# Altium project DE-010824.PrjPcb
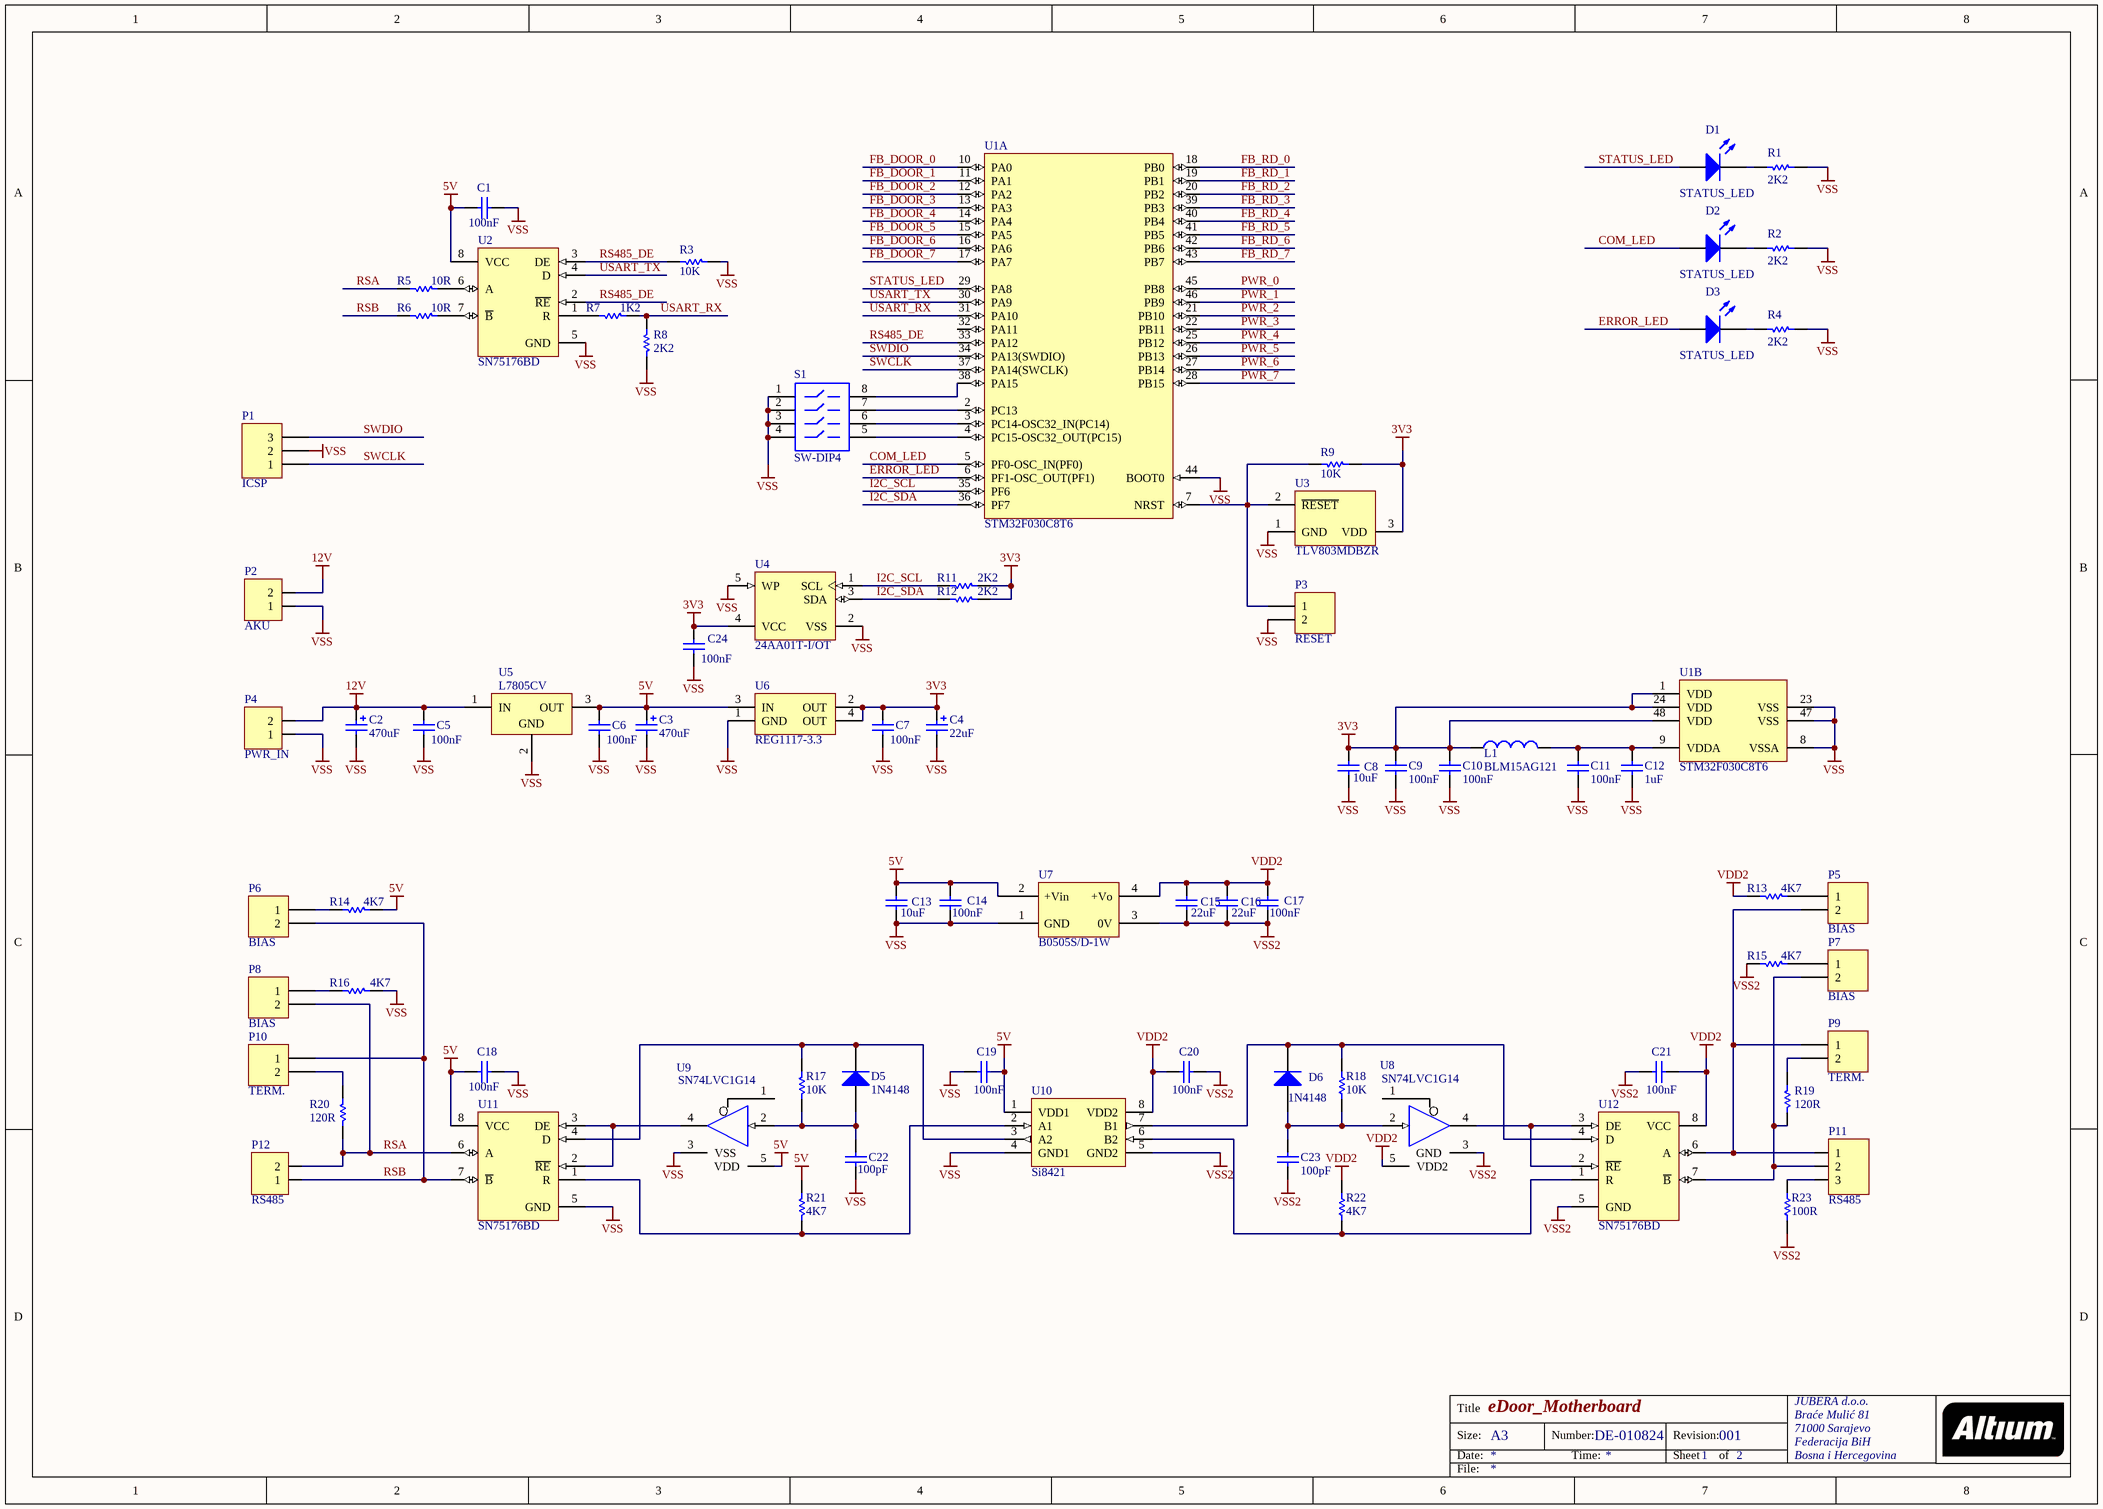
[diagram p0: DE-010824.SchDoc]
2 sheets, 221 parts. Net scope: global (net labels, ports and power ports of the same name join across sheets).
Board file: DE-010824.PcbDoc
Sheets:
  DE-010824.SchDoc
  DE-010824_02.SchDoc

## Sheet DE-010824.SchDoc: eDoor_Motherboard
size A3; Author: eldar6776@hotmail.com; DrawnBy: Eldar Dedic; Organization: JUBERA d.o.o.; Address1: Braće Mulić 81; Address2: 71000 Sarajevo; Address3: Federacija BiH; Address4: Bosna i Hercegovina; DocumentNumber: DE-010824; Revision: 001; SheetNumber: 1; SheetTotal: 2

### Parts
C1  100nF  [0603]
C2  470uF  [CAPPR5-10X12.5]
C3  470uF  [CAPPR5-10X12.5]
C4  22uF  [CAPPR2-5X11]
C5  100nF  [0603]
C6  100nF  [0603]
C7  100nF  [0603]
C8  10uF  [0805]
C9  100nF  [0603]
C10  100nF  [0603]
C11  100nF  [0603]
C12  1uF  [0603]
C13  10uF  [0805]
C14  100nF  [0603]
C15  22uF  [0805]
C16  22uF  [0805]
C17  100nF  [0603]
C18  100nF  [0603]
C19  100nF  [0603]
C20  100nF  [0603]
C21  100nF  [0603]
C22  100pF  [0603]
C23  100pF  [0603]
C24  100nF  [0603]
D1  STATUS_LED  [1.6X0.8X0.8]
D2  STATUS_LED  [1.6X0.8X0.8]
D3  STATUS_LED  [1.6X0.8X0.8]
D5  1N4148  [SOD323]
D6  1N4148  [SOD323]
L1  BLM15AG121  [0603]
P1  ICSP  [HDR1X3]
P2  AKU  [TERMINAL BLOK 2]
P3  RESET  [HDR1X2]
P4  PWR_IN  [TERMINAL BLOK 2]
P5  BIAS  [HDR1X2]
P6  BIAS  [HDR1X2]
P7  BIAS  [HDR1X2]
P8  BIAS  [HDR1X2]
P9  TERM.  [HDR1X2]
P10  TERM.  [HDR1X2]
P11  RS485  [TERMINAL BLOK 3]
P12  RS485  [TERMINAL BLOK 2]
R1  2K2  [ERA-0603]
R2  2K2  [ERA-0603]
R3  10K  [ERA-0603]
R4  2K2  [ERA-0603]
R5  10R  [ERA-0603]
R6  10R  [ERA-0603]
R7  1K2  [ERA-0603]
R8  2K2  [ERA-0603]
R9  10K  [ERA-0603]
R11  2K2  [ERA-0603]
R12  2K2  [ERA-0603]
R13  4K7  [ERA-0603]
R14  4K7  [ERA-0603]
R15  4K7  [ERA-0603]
R16  4K7  [ERA-0603]
R17  10K  [ERA-0603]
R18  10K  [ERA-0603]
R19  120R  [ERA-0603]
R20  120R  [ERA-0603]
R21  4K7  [ERA-0603]
R22  4K7  [ERA-0603]
R23  100R  [ERA-0805]
S1  SW-DIP4  [DIP-8]
U1  STM32F030C8T6  [STM-LQFP48_N]  (parts A,B of 2)
U2  SN75176BD  [D008_N]
U3  TLV803MDBZR  [DBZ3_N]
U4  24AA01T-I/OT  [SOT-23-OT5_N]
U5  L7805CV  [TO220]
U6  REG1117-3.3  [ZZ311]
U7  B0505S/D-1W  [B0505S-1W]
U8  SN74LVC1G14  [419A-01_N]
U9  SN74LVC1G14  [419A-01_N]
U10  Si8421  [SOP8]
U11  SN75176BD  [D008_N]
U12  SN75176BD  [D008_N]

### Nets
3V3: C4.1 C7.2 C8.2 C9.1 C10.1 C24.2 L1.1 R9.2 R11.2 R12.2 U1.1(VDD) U1.24(VDD) U1.48(VDD) U3.3(VDD) U4.4(VCC) U6.2(OUT) U6.4(OUT)
5V: C1.1 C3.1 C6.2 C13.2 C14.2 C15.2 C16.2 C17.2 C18.1 C19.2 C20.2 C21.1 R13.2 R14.2 R21.2 R22.2 U2.8(VCC) U5.3(OUT) U6.3(IN) U7.2(+Vin) U7.4(+Vo) U8.5(VDD2) U9.5(VDD) U10.1(VDD1) U10.8(VDD2) U11.8(VCC) U12.8(VCC)  [also labelled VDD, VDD2]
12V: C2.1 C5.2 P2.2 P4.2 U5.1(IN)
GND: C1.2 C2.2 C3.2 C4.2 C5.1 C6.1 C7.1 C8.1 C9.2 C10.2 C11.2 C12.2 C13.1 C14.1 C15.1 C16.1 C17.1 C18.2 C19.1 C20.1 C21.2 C22.1 C23.1 C24.1 P1.2 P2.1 P3.2 P4.1 R1.1 R2.1 R3.1 R4.1 R8.2 R15.2 R16.2 R23.1 S1.1 S1.2 S1.3 S1.4 U1.8(VSSA) U1.23(VSS) U1.44(BOOT0) U1.47(VSS) U2.5(GND) U3.1(GND) U4.2(VSS) U4.5(WP) U5.2(GND) U6.1(GND) U7.1(GND) U7.3(0V) U8.3(GND) U9.3(VSS) U10.4(GND1) U10.5(GND2) U11.5(GND) U12.5(GND)  [also labelled VSS, VSS2]
COM_LED: D2.1(A) U1.5(PF0-OSC_IN(PF0))
ERROR_LED: D3.1(A) U1.6(PF1-OSC_OUT(PF1))
FB_DOOR_0: U1.10(PA0)
FB_DOOR_1: U1.11(PA1)
FB_DOOR_2: U1.12(PA2)
FB_DOOR_3: U1.13(PA3)
FB_DOOR_4: U1.14(PA4)
FB_DOOR_5: U1.15(PA5)
FB_DOOR_6: U1.16(PA6)
FB_DOOR_7: U1.17(PA7)
FB_RD_0: U1.18(PB0)
FB_RD_1: U1.19(PB1)
FB_RD_2: U1.20(PB2)
FB_RD_3: U1.39(PB3)
FB_RD_4: U1.40(PB4)
FB_RD_5: U1.41(PB5)
FB_RD_6: U1.42(PB6)
FB_RD_7: U1.43(PB7)
I2C_SCL: R11.1 U1.35(PF6) U4.1(SCL)
I2C_SDA: R12.1 U1.36(PF7) U4.3(SDA)
PWR_0: U1.45(PB8)
PWR_1: U1.46(PB9)
PWR_2: U1.21(PB10)
PWR_3: U1.22(PB11)
PWR_4: U1.25(PB12)
PWR_5: U1.26(PB13)
PWR_6: U1.27(PB14)
PWR_7: U1.28(PB15)
RS485_DE: R3.2 U1.33(PA12) U2.2(~{RE}) U2.3(DE)
RSA: P8.2 P12.2 R5.1 R20.1 U11.6(A)
RSB: P6.2 P10.1 P12.1 R6.1 U11.7(~{B})
STATUS_LED: D1.1(A) U1.29(PA8)
SWCLK: P1.1 U1.37(PA14(SWCLK))
SWDIO: P1.3 U1.34(PA13(SWDIO))
USART_RX: R7.1 R8.1 U1.31(PA10)
USART_TX: U1.30(PA9) U2.4(D)
NetC11_1: C11.1 C12.1 L1.2 U1.9(VDDA)
NetC22_2: C22.2 D5.2(A) R17.1 U9.2(A)
NetC23_2: C23.2 D6.2(A) R18.1 U8.2(A)
NetD1_2: D1.2(K) R1.2
NetD2_2: D2.2(K) R2.2
NetD3_2: D3.2(K) R4.2
NetD5_1: D5.1(K) R17.2 U10.3(A2) U11.4(D)
NetD6_1: D6.1(K) R18.2 U10.7(B1) U12.4(D)
NetP3_1: P3.1 R9.1 U1.7(NRST) U3.2(~{RESET})
NetP5_1: P5.1 R13.1
NetP5_2: P5.2 P9.1 P11.1 U12.6(A)
NetP6_1: P6.1 R14.1
NetP7_1: P7.1 R15.1
NetP7_2: P7.2 P11.2 R19.1 U12.7(~{B})
NetP8_1: P8.1 R16.1
NetP9_2: P9.2 R19.2
NetP10_2: P10.2 R20.2
NetP11_3: P11.3 R23.2
NetR5_2: R5.2 U2.6(A)
NetR6_2: R6.2 U2.7(~{B})
NetR7_2: R7.2 U2.1(R)
NetR21_1: R21.1 U10.2(A1) U11.1(R)
NetR22_1: R22.1 U10.6(B2) U12.1(R)
NetS1_5: S1.5 U1.4(PC15-OSC32_OUT(PC15))
NetS1_6: S1.6 U1.3(PC14-OSC32_IN(PC14))
NetS1_7: S1.7 U1.2(PC13)
NetS1_8: S1.8 U1.38(PA15)
NetU8_4: U8.4(Y) U12.2(~{RE}) U12.3(DE)
NetU9_4: U9.4(Y) U11.2(~{RE}) U11.3(DE)

Not connected (* = marked no-connect by the designer): U1 32(PA11); U8 1(NC); U9 1(NC)

### Notes on the sheet
- Title
- Size:
- Date:
- A3
- Number:
- Time:
- Revision:
- Sheet
- of
- File:

### Library data of the parts
C1 C5-C7 C9-C11 C14 C17-C24 = C0603: Ceramic Chip Capacitor - Standard; Note: Footprint corresponds to dimensions for bulk cassette packaging. This case size has tightened tolerances.; Published: 17-Jul-2002; LatestRevisionDate: 19-Mar-2004; LatestRevisionNote: Silkscreen size reduced.; DatasheetDocument: Mar-2001; PackageDocument: Mar-2001; PackageReference: 0603; Publisher: Altium Limited; Code_JEITA: 0603; Code_IPC: 1608 [0603]; ComponentLink1Description: Manufacturer Link; ComponentLink1URL: http://www.kemet.com/; ComponentLink2Description: Datasheet; ComponentLink2URL: http://www.kemet.com/kemet/web/homepage/kechome.nsf/vapubfilesname/F3102TA.pdf/$file/F3102TA.pdf
  C1 C5-C7 C9-C11 C14 C17-C21 C24: Value: 100nF
  C22 C23: Value: 100pF
C2 C3 = EKA00DC347E00: Aluminum Electrolytic Capacitor, Radial Style with Long Leads: 470uF, 25V; Note: Refer to Manufacturer's Data Sheets for other lead formations; DrillSize: Nominal, Rounded To The Nearest 0.1mm; Published: 19-Mar-2004; DatasheetDocument: 20-Feb-2001; PackageReference: CAPPR5-10X12.5; Publisher: Altium Limited; ComponentLink1Description: Manufacturer Link; ComponentLink1URL: http://www.vishay.com/; ComponentLink2Description: Datasheet; ComponentLink2URL: http://www.vishay.com/docs/25014/eka.pdf; Value: 470uF
C4 = EKA00AA247F00: Aluminum Electrolytic Capacitor, Radial Style with Long Leads: 47uF, 35V; Note: Refer to Manufacturer's Data Sheets for other lead formations; DrillSize: Nominal, Rounded To The Nearest 0.1mm; Published: 19-Mar-2004; DatasheetDocument: 20-Feb-2001; PackageReference: CAPPR2-5X11; Publisher: Altium Limited; ComponentLink1Description: Manufacturer Link; ComponentLink1URL: http://www.vishay.com/; ComponentLink2Description: Datasheet; ComponentLink2URL: http://www.vishay.com/docs/25014/eka.pdf; Value: 47uF
C8 C13 = C0805: Ceramic Chip Capacitor - Standard; Note: Footprint corresponds to dimensions for bulk cassette packaging. This case size has tightened tolerances.; Published: 17-Jul-2002; LatestRevisionDate: 19-Mar-2004; LatestRevisionNote: Silkscreen size reduced.; DatasheetDocument: Mar-2001; PackageDocument: Mar-2001; PackageReference: 0805; Publisher: Altium Limited; Code_JEITA: 0805; Code_IPC: 2012[0805]; ComponentLink1Description: Manufacturer Link; ComponentLink1URL: http://www.kemet.com/; ComponentLink2Description: Datasheet; ComponentLink2URL: http://www.kemet.com/kemet/web/homepage/kechome.nsf/vapubfilesname/F3102TA.pdf/$file/F3102TA.pdf; Value: 10uF
C12 = C0603: Ceramic Chip Capacitor - Standard; Note: Footprint corresponds to dimensions for bulk cassette packaging. This case size has tightened tolerances.; Value: 100nF; Published: 17-Jul-2002; LatestRevisionDate: 19-Mar-2004; LatestRevisionNote: Silkscreen size reduced.; DatasheetDocument: Mar-2001; PackageDocument: Mar-2001; PackageReference: 0603; Publisher: Altium Limited; Code_JEITA: 0603; Code_IPC: 1608 [0603]; ComponentLink1Description: Manufacturer Link; ComponentLink1URL: http://www.kemet.com/; ComponentLink2Description: Datasheet; ComponentLink2URL: http://www.kemet.com/kemet/web/homepage/kechome.nsf/vapubfilesname/F3102TA.pdf/$file/F3102TA.pdf
C15 C16 = C0805: Ceramic Chip Capacitor - Standard; Note: Footprint corresponds to dimensions for bulk cassette packaging. This case size has tightened tolerances.; Value: 10uF; Published: 17-Jul-2002; LatestRevisionDate: 19-Mar-2004; LatestRevisionNote: Silkscreen size reduced.; DatasheetDocument: Mar-2001; PackageDocument: Mar-2001; PackageReference: 0805; Publisher: Altium Limited; Code_JEITA: 0805; Code_IPC: 2012[0805]; ComponentLink1Description: Manufacturer Link; ComponentLink1URL: http://www.kemet.com/; ComponentLink2Description: Datasheet; ComponentLink2URL: http://www.kemet.com/kemet/web/homepage/kechome.nsf/vapubfilesname/F3102TA.pdf/$file/F3102TA.pdf
D1-D3 = HSMB-C190: Blue Surface Mount Chip LED, Blue; LuminousIntensity: 1.6mcd (Minimum).; PCB_Layout: Complies with manufacturer's recommendation.; Published: 11-Dec-2002; DatasheetVersion: 26-Feb-2002; PackageVersion: Mar-2002; PackageReference: 1.6X0.8X0.8; Publisher: Altium Limited; PackageDescription: SM LED; 2 Flat Leads; LED_Colour: Blue; ComponentLink1Description: Manufacturer Link; ComponentLink1URL: http://www.avagotech.com/; ComponentLink2Description: Datasheet; ComponentLink2URL: http://cp.literature.agilent.com/litweb/pdf/5988-5211EN.pdf
D5 D6 = BAS321: General-purpose Diode; Published: 17-Sep-2003; LatestRevisionDate: 19-Mar-2004; LatestRevisionNote: Silkscreen size reduced.; DatasheetVersion: 9-Feb-1999; PackageVersion: May-1999; PackageReference: SOD323; Publisher: Altium Limited; PackageDescription: SOD-323/SC-76; 2 Leads; Body 1.7 x 1.3 mm, (LxW); ComponentLink1Description: Manufacturer Link; ComponentLink1URL: http://www.semiconductors.philips.com/; ComponentLink2Description: Datasheet; ComponentLink2URL: http://www.semiconductors.philips.com/acrobat/datasheets/BAS321_2.pdf
L1 = Chip inductor: SMD chip inductor; Code_IEC: 1005; Published: 8-Jun-2000; LatestRevisionDate: 29-May-2009; LatestRevisionNote: IPC-7351 Footprint Added.; PackageReference: 0402-A; Publisher: Altium Limited; PackageDescription: Chip Inductor; Code_JEITA: 0402
P1 = Header 3: Header, 3-Pin; LatestRevisionDate: 17-Jul-2002; LatestRevisionNote: Re-released for DXP Platform.; Publisher: Altium Limited
P2 P4 P12 = TERMINAL BLOK 2: Terminal blok konektor 3,5 mm
P3 P5-P10 = Header 2: Header, 2-Pin; LatestRevisionDate: 17-Jul-2002; LatestRevisionNote: Re-released for DXP Platform.; Publisher: Altium Limited
P11 = TERMINAL BLOK 3: 3 pinski terminal blok konektor
R1-R9 R11-R22 = ERAV: Metal Film Thermosensitive Chip Resistor, 0.56 Ohm to 10k Ohm Range, 5% Tolerance, 0603 Size, 0.063 W; Note: If flow soldering, adjust pad width of PCB Footprint to 0.7 - 0.8 times the width of the resistor.; Published: 17-Dec-2003; LatestRevisionDate: 19-Mar-2004; LatestRevisionNote: Silkscreen size reduced.; PackageDocument: Mar-2003; PackageReference: ERA-0603; Publisher: Altium Limited; Code_IPC: 1608 [0603]; ComponentLink1Description: Manufacturer Link; ComponentLink1URL: http://www.panasonic.com/industrial/components/resistive_products.htm; ComponentLink2Description: Datasheet; ComponentLink2URL: http://www.panasonic.com/industrial/components/pdf/AOF0000CE1.pdf
R23 = ERA6Y: Rectangular Thick Film Chip Resistor, 10 Ohm to 1M Ohm Range, 0.1% and 0.5% Tolerance, 0805 Size, 0.1 W; Note: If flow soldering, adjust pad width of PCB Footprint to 0.7 - 0.8 times the width of the resistor.; Published: 17-Dec-2003; LatestRevisionDate: 19-Mar-2004; LatestRevisionNote: Silkscreen size reduced.; PackageDocument: Mar-2003; PackageReference: ERA-0805; Publisher: Altium Limited; Code_IPC: 2012 [0805]; ComponentLink1Description: Manufacturer Link; ComponentLink1URL: http://www.panasonic.com/industrial/components/resistive_products.htm; ComponentLink2Description: Datasheet; ComponentLink2URL: http://www.panasonic.com/industrial/components/pdf/AOA0000CE8.pdf
S1 = SW-DIP4: DIP Switch; Published: 24-Mar-1999; LatestRevisionDate: 17-Jul-2002; LatestRevisionNote: Re-released for DXP Platform.; PackageReference: DIP-8; Publisher: Altium Limited
U1 = STM32F030C8T6: ARM Cortex-M0 32-bit MCU, 64 KB Flash, 8 KB Internal RAM, 39 I/Os, 48-pin LQFP, -40 to 85 degC, Tray; FLASH Size (Prog) (kB): 64; I/Os (High Current): 39; Internal RAM Size (kB): 8; Operating Frequency(F) (Processor speed) (MHz): 48; Supply Voltage(Vcc) min (V): 2.4; DatasheetVersion: Rev. 1; PackageVersion: Rev. 6, 06/2013; PackageReference: LQFP48; PackageDescription: 48-Pin Low Profile Quad Flat Package, 7 x 7 mm Body, 0.5 mm Pitch; Supplier 1: Digi-Key; Supplier Part Number 1: 497-14043-ND; Supplier 2: Newark; Supplier Part Number 2: 06X3647; Supplier 3: Mouser; Supplier Part Number 3: 511-STM32F030C8T6; Core: ARM Cortex-M0; Packing: Tray; Mounting Technology: Surface Mount; PartNumber: STM32F030C8T6; ComponentLink1Description: Manufacturer URL; ComponentLink1URL: http://www.st.com/web/en/home.html; ComponentLink2Description: Datasheet; ComponentLink2URL: http://www.st.com/st-web-ui/static/active/en/resource/technical/document/datasheet/DM00088500.pdf; ComponentLink3Description: Package Specification; ComponentLink3URL: http://www.st.com/st-web-ui/static/active/en/resource/technical/document/datasheet/DM00058181.pdf
U2 U11 U12 = SN75176BD: Differential Bus Transceiver; Note: Receiver Hysteresis of 50mV Typical; Published: 15-May-2002; LatestRevisionDate: 13-Apr-2006; LatestRevisionNote: IPC-7351 Footprint Added.; DatasheetVersion: Sep-1989; PackageVersion: Jan-1998; PackageReference: D008; Publisher: Altium Limited; PackageDescription: 8-Pin Small Outline Integrated Circuit 1.27 mm Pitch; Code_IPC: SOIC127P600-8; ComponentLink1Description: Manufacturer Link; ComponentLink1URL: http://www.ti.com/; ComponentLink2Description: Datasheet; ComponentLink2URL: http://www-s.ti.com/sc/ds/sn75176b.pdf
U3 = TLV803MDBZR: Voltage Supervisor with Active-Low, Open Drain Reset, 1 Supply Monitored, -40 to 125 degC, 3-pin SOT-23 (DBZ), Green (RoHS & no Sb/Br); Manufacturer: Texas Instruments; # of supplies monitored: 1; Iq(Typ)(uA): 9; Output Driver Type / Reset Output: Active-low, Open-drain; Rating: Catalog; Reset Threshold Accuracy(%): 2; SubFamily: Supervisor and Reset IC; Threshold Voltage 1 (typ)(Typ)(V): 4.38; Time Delay(ms): 200; VCC(Max)(V): 6; VCC(Min)(V): 1.1; DatasheetVersion: SBVS157B; PackageVersion: revB, Apr-2005; PackageReference: DBZ3; PackageDescription: 3-Pin Plastic Small-Outline Package, 0.95 mm Pitch, 2.4 mm Lead Span; Supplier 1: Digi-Key; Supplier Part Number 1: 296-29194-2-ND; Supplier 2: Digi-Key; Supplier Part Number 2: 296-29194-1-ND; Supplier 3: Digi-Key; Supplier Part Number 3: 296-29194-6-ND; Supplier 4: Newark; Supplier Part Number 4: 58T0286; Supplier 5: Mouser; Supplier Part Number 5: 595-TLV803MDBZR; Mounting Technology: Surface Mount; Code_JEDEC: TO-236-AB; PartNumber: TLV803MDBZR; ComponentLink1Description: Datasheet; ComponentLink1URL: http://www.ti.com/general/docs/lit/getliterature.tsp?genericPartNumber=TLV803M&fileType=pdf
U4 = 24AA01T-I/OT: 1Kbit, 400kHz, 1.8V, I2C Serial EEPROM, 5-Pin SOT-23, Industrial Temperature, Tape and Reel; Published: 29-Jan-2009; DatasheetVersion: revJ, Jan-2009; PackageVersion: revBB, Aug-2009; PackageReference: SOT-23-OT5; Publisher: Altium Limited; PackageDescription: 5-Lead Plastic Small Outline Transistor (OT) [SOT-23]; Supplier 1: Digi-Key; Supplier Part Number 1: 24AA01T-I/OTTR-ND; Supplier 2: Digi-Key; Supplier Part Number 2: 24AA01T-I/OTCT-ND; Supplier 3: Digi-Key; Supplier Part Number 3: 24AA01T-I/OTDKR-ND; Supplier 4: Farnell; Supplier Part Number 4: 1331269; Code_IPC: SOT23-5; ComponentLink1Description: Datasheet; ComponentLink1URL: http://ww1.microchip.com/downloads/en/DeviceDoc/21711J.pdf; ComponentLink2Description: Packaging Specification; ComponentLink2URL: http://www.microchip.com/stellent/groups/techpub_sg/documents/packagingspec/en012702.pdf; ComponentLink3Description: Microchip.com Home; ComponentLink3URL: http://www.microchip.com/
U5 = L7805CV: Positive Voltage Regulator, 5V, 3-Pin TO-220; DatasheetVersion: Nov-2011; PackageVersion: ver3.0; PackageReference: TO220; PackageDescription: TO, Thru-Hole, Vertical, Heatsink Mounted; 3 In-Line Leads; Pitch 2.54 mm; PartNumber: L7805CV; ComponentLink1Description: Manufacturer URL; ComponentLink1URL: http://www.st.com; ComponentLink2Description: Datasheet; ComponentLink2URL: http://www.st.com/internet/com/TECHNICAL_RESOURCES/TECHNICAL_LITERATURE/DATASHEET/CD00000444.pdf; ComponentLink3Description: Package Specification; ComponentLink3URL: http://www.st.com/internet/com/TECHNICAL_RESOURCES/TECHNICAL_LITERATURE/PACKAGE_INFORMATION/CD00004649.pdf
U6 = REG1117-3.3: 800mA and 1A Low Dropout Positive Regulator 2.85V, 3.3V, 5V, and Adjustable; Published: 8-Jun-2000; LatestRevisionDate: 17-Jul-2002; LatestRevisionNote: Re-released for DXP Platform.; DatasheetVersion: Sep-1997; PackageVersion: revC; PackageReference: ZZ311; Publisher: Altium Limited; PackageDescription: SOT-223/SC-73; 4 Leads; Body 6.7 x 7.3 mm, inc. leads (LxW max); ComponentLink1Description: Manufacturer Link; ComponentLink1URL: http://www.ti.com/; ComponentLink2Description: Datasheet; ComponentLink2URL: http://www-s.ti.com/sc/ds/REG1117.pdf
U7 = B0505S/D: 1W isolated dc dc converter
U8 U9 = MC74VHC1G125DFT1: Non-Inverting 3-State Buffer; Published: 15-Apr-2002; LatestRevisionDate: 12-Dec-2006; LatestRevisionNote: IPC-7351 Footprint Added.; DatasheetVersion: Feb-2000; PackageVersion: Oct-1999; PackageReference: 419A-01; Publisher: Altium Limited; PackageDescription: 5-Pin SOT-353 Package 0.65 mm Pitch, 2.1 mm Lead Span; ComponentLink1Description: Manufacturer Link; ComponentLink1URL: http://www.onsemi.com/; ComponentLink2Description: Datasheet; ComponentLink2URL: http://www.onsemi.com/pub/Collateral/MC74VHC1G125-D.PDF
U10 = Si8421: Silicon Labs low power dual chanel digital isolator

## Sheet DE-010824_02.SchDoc: eDoor_Motherboard
size A3; Author: eldar6776@hotmail.com; DrawnBy: Eldar Dedic; Organization: JUBERA d.o.o.; Address1: Braće Mulić 81; Address2: 71000 Sarajevo; Address3: Federacija BiH; Address4: Bosna i Hercegovina; DocumentNumber: DE-010824; Revision: 001; SheetNumber: 1; SheetTotal: 2
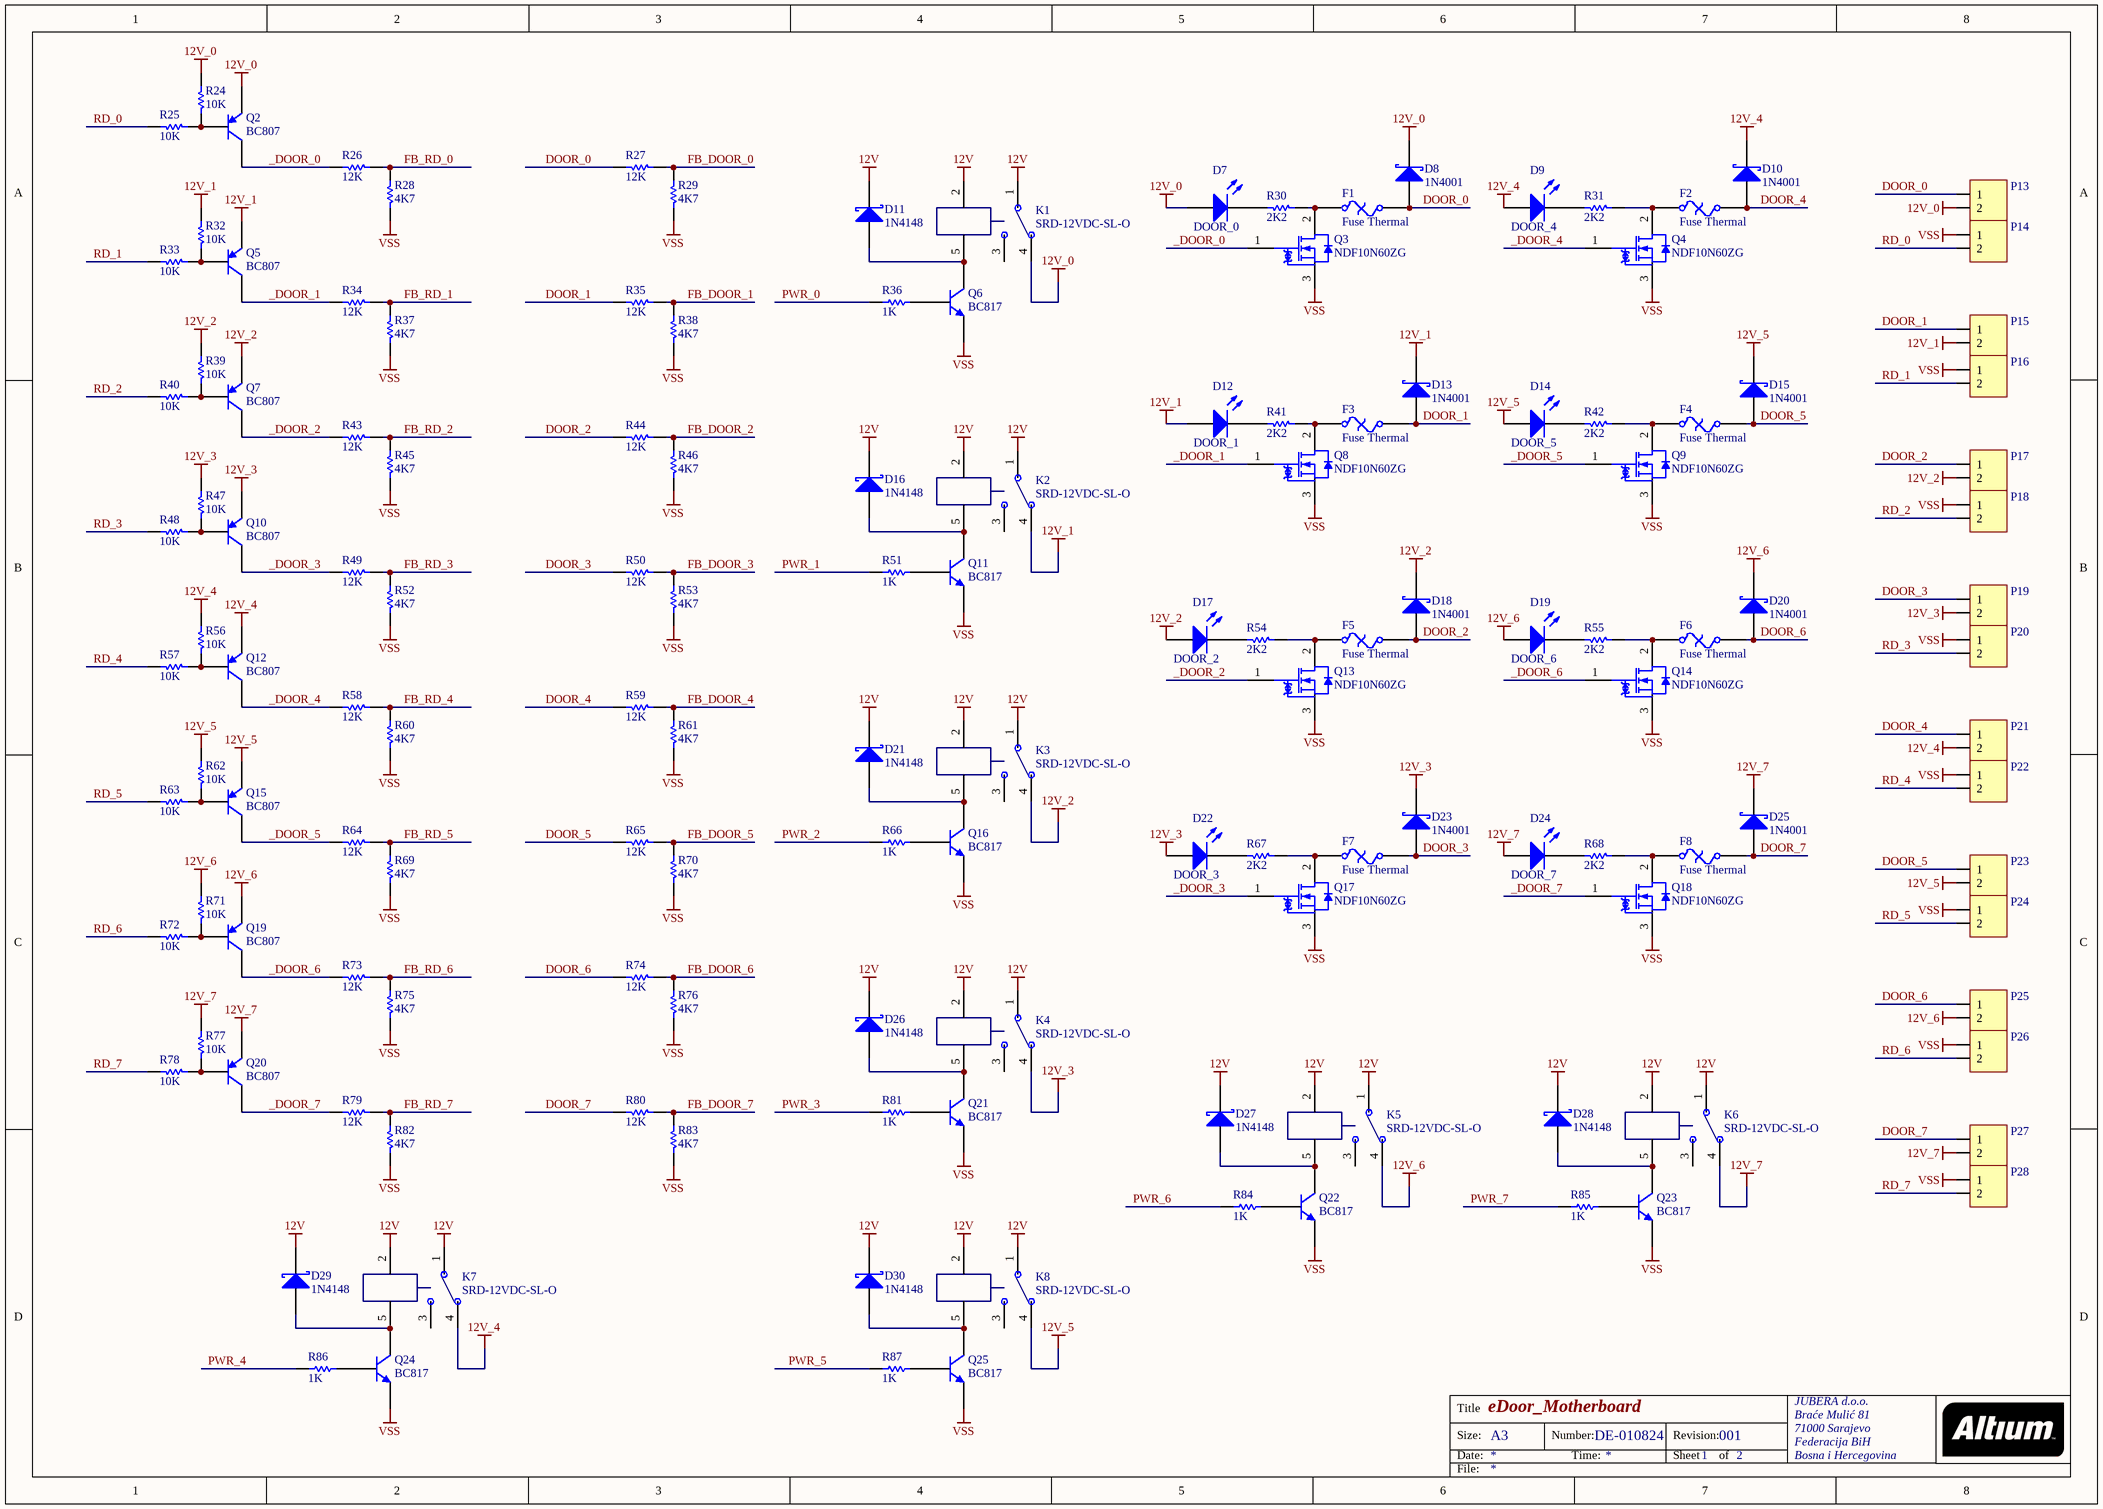
[diagram p1: DE-010824_02.SchDoc]

### Parts
D7  DOOR_0  [1.6X0.8X0.8]
D8  1N4001  [SMB]
D9  DOOR_4  [1.6X0.8X0.8]
D10  1N4001  [SMB]
D11  1N4148  [SOD323]
D12  DOOR_1  [1.6X0.8X0.8]
D13  1N4001  [SMB]
D14  DOOR_5  [1.6X0.8X0.8]
D15  1N4001  [SMB]
D16  1N4148  [SOD323]
D17  DOOR_2  [1.6X0.8X0.8]
D18  1N4001  [SMB]
D19  DOOR_6  [1.6X0.8X0.8]
D20  1N4001  [SMB]
D21  1N4148  [SOD323]
D22  DOOR_3  [1.6X0.8X0.8]
D23  1N4001  [SMB]
D24  DOOR_7  [1.6X0.8X0.8]
D25  1N4001  [SMB]
D26  1N4148  [SOD323]
D27  1N4148  [SOD323]
D28  1N4148  [SOD323]
D29  1N4148  [SOD323]
D30  1N4148  [SOD323]
F1  Fuse Thermal  [PIN-W2/E2.8]
F2  Fuse Thermal  [PIN-W2/E2.8]
F3  Fuse Thermal  [PIN-W2/E2.8]
F4  Fuse Thermal  [PIN-W2/E2.8]
F5  Fuse Thermal  [PIN-W2/E2.8]
F6  Fuse Thermal  [PIN-W2/E2.8]
F7  Fuse Thermal  [PIN-W2/E2.8]
F8  Fuse Thermal  [PIN-W2/E2.8]
K1  SRD-12VDC-SL-O  [SRD-12VDC-SL-O]
K2  SRD-12VDC-SL-O  [SRD-12VDC-SL-O]
K3  SRD-12VDC-SL-O  [SRD-12VDC-SL-O]
K4  SRD-12VDC-SL-O  [SRD-12VDC-SL-O]
K5  SRD-12VDC-SL-O  [SRD-12VDC-SL-O]
K6  SRD-12VDC-SL-O  [SRD-12VDC-SL-O]
K7  SRD-12VDC-SL-O  [SRD-12VDC-SL-O]
K8  SRD-12VDC-SL-O  [SRD-12VDC-SL-O]
P13  DOOR_0  [TERMINAL BLOK 2]  (value not drawn)
P14  GND  [TERMINAL BLOK 2]  (value not drawn)
P15  DOOR_0  [TERMINAL BLOK 2]  (value not drawn)
P16  GND  [TERMINAL BLOK 2]  (value not drawn)
P17  DOOR_0  [TERMINAL BLOK 2]  (value not drawn)
P18  GND  [TERMINAL BLOK 2]  (value not drawn)
P19  DOOR_0  [TERMINAL BLOK 2]  (value not drawn)
P20  GND  [TERMINAL BLOK 2]  (value not drawn)
P21  DOOR_0  [TERMINAL BLOK 2]  (value not drawn)
P22  GND  [TERMINAL BLOK 2]  (value not drawn)
P23  DOOR_0  [TERMINAL BLOK 2]  (value not drawn)
P24  GND  [TERMINAL BLOK 2]  (value not drawn)
P25  DOOR_0  [TERMINAL BLOK 2]  (value not drawn)
P26  GND  [TERMINAL BLOK 2]  (value not drawn)
P27  DOOR_0  [TERMINAL BLOK 2]  (value not drawn)
P28  GND  [TERMINAL BLOK 2]  (value not drawn)
Q2  BC807  [SOT23_N]
Q3  NDF10N60ZG  [ONSC-TO-220-3-221D-03]
Q4  NDF10N60ZG  [ONSC-TO-220-3-221D-03]
Q5  BC807  [SOT23_N]
Q6  BC817  [SOT23_N]
Q7  BC807  [SOT23_N]
Q8  NDF10N60ZG  [ONSC-TO-220-3-221D-03]
Q9  NDF10N60ZG  [ONSC-TO-220-3-221D-03]
Q10  BC807  [SOT23_N]
Q11  BC817  [SOT23_N]
Q12  BC807  [SOT23_N]
Q13  NDF10N60ZG  [ONSC-TO-220-3-221D-03]
Q14  NDF10N60ZG  [ONSC-TO-220-3-221D-03]
Q15  BC807  [SOT23_N]
Q16  BC817  [SOT23_N]
Q17  NDF10N60ZG  [ONSC-TO-220-3-221D-03]
Q18  NDF10N60ZG  [ONSC-TO-220-3-221D-03]
Q19  BC807  [SOT23_N]
Q20  BC807  [SOT23_N]
Q21  BC817  [SOT23_N]
Q22  BC817  [SOT23_N]
Q23  BC817  [SOT23_N]
Q24  BC817  [SOT23_N]
Q25  BC817  [SOT23_N]
R24  10K  [ERA-0603]
R25  10K  [ERA-0603]
R26  12K  [ERA-0603]
R27  12K  [ERA-0603]
R28  4K7  [ERA-0603]
R29  4K7  [ERA-0603]
R30  2K2  [ERA-0603]
R31  2K2  [ERA-0603]
R32  10K  [ERA-0603]
R33  10K  [ERA-0603]
R34  12K  [ERA-0603]
R35  12K  [ERA-0603]
R36  1K  [ERA-0603]
R37  4K7  [ERA-0603]
R38  4K7  [ERA-0603]
R39  10K  [ERA-0603]
R40  10K  [ERA-0603]
R41  2K2  [ERA-0603]
R42  2K2  [ERA-0603]
R43  12K  [ERA-0603]
R44  12K  [ERA-0603]
R45  4K7  [ERA-0603]
R46  4K7  [ERA-0603]
R47  10K  [ERA-0603]
R48  10K  [ERA-0603]
R49  12K  [ERA-0603]
R50  12K  [ERA-0603]
R51  1K  [ERA-0603]
R52  4K7  [ERA-0603]
R53  4K7  [ERA-0603]
R54  2K2  [ERA-0603]
R55  2K2  [ERA-0603]
R56  10K  [ERA-0603]
R57  10K  [ERA-0603]
R58  12K  [ERA-0603]
R59  12K  [ERA-0603]
R60  4K7  [ERA-0603]
R61  4K7  [ERA-0603]
R62  10K  [ERA-0603]
R63  10K  [ERA-0603]
R64  12K  [ERA-0603]
R65  12K  [ERA-0603]
R66  1K  [ERA-0603]
R67  2K2  [ERA-0603]
R68  2K2  [ERA-0603]
R69  4K7  [ERA-0603]
R70  4K7  [ERA-0603]
R71  10K  [ERA-0603]
R72  10K  [ERA-0603]
R73  12K  [ERA-0603]
R74  12K  [ERA-0603]
R75  4K7  [ERA-0603]
R76  4K7  [ERA-0603]
R77  10K  [ERA-0603]
R78  10K  [ERA-0603]
R79  12K  [ERA-0603]
R80  12K  [ERA-0603]
R81  1K  [ERA-0603]
R82  4K7  [ERA-0603]
R83  4K7  [ERA-0603]
R84  1K  [ERA-0603]
R85  1K  [ERA-0603]
R86  1K  [ERA-0603]
R87  1K  [ERA-0603]

### Nets
12V: D11.1(K) D16.1(K) D21.1(K) D26.1(K) D27.1(K) D28.1(K) D29.1(K) D30.1(K) K1.1 K1.2 K2.1 K2.2 K3.1 K3.2 K4.1 K4.2 K5.1 K5.2 K6.1 K6.2 K7.1 K7.2 K8.1 K8.2
12V_0: D7.1(A) D8.2(K) K1.4 P13.2 Q2.2(E) R24.2
12V_1: D12.1(A) D13.2(K) K2.4 P15.2 Q5.2(E) R32.2
12V_2: D17.1(A) D18.2(K) K3.4 P17.2 Q7.2(E) R39.2
12V_3: D22.1(A) D23.2(K) K4.4 P19.2 Q10.2(E) R47.2
12V_4: D9.1(A) D10.2(K) K7.4 P21.2 Q12.2(E) R56.2
12V_5: D14.1(A) D15.2(K) K8.4 P23.2 Q15.2(E) R62.2
12V_6: D19.1(A) D20.2(K) K5.4 P25.2 Q19.2(E) R71.2
12V_7: D24.1(A) D25.2(K) K6.4 P27.2 Q20.2(E) R77.2
VSS: P14.1 P16.1 P18.1 P20.1 P22.1 P24.1 P26.1 P28.1 Q3.3(S) Q4.3(S) Q6.2(E) Q8.3(S) Q9.3(S) Q11.2(E) Q13.3(S) Q14.3(S) Q16.2(E) Q17.3(S) Q18.3(S) Q21.2(E) Q22.2(E) Q23.2(E) Q24.2(E) Q25.2(E) R28.1 R29.1 R37.1 R38.1 R45.1 R46.1 R52.1 R53.1 R60.1 R61.1 R69.1 R70.1 R75.1 R76.1 R82.1 R83.1  [project net GND]
_DOOR_0: Q2.3(C) Q3.1(G) R26.1
_DOOR_1: Q5.3(C) Q8.1(G) R34.1
_DOOR_2: Q7.3(C) Q13.1(G) R43.1
_DOOR_3: Q10.3(C) Q17.1(G) R49.1
_DOOR_4: Q4.1(G) Q12.3(C) R58.1
_DOOR_5: Q9.1(G) Q15.3(C) R64.1
_DOOR_6: Q14.1(G) Q19.3(C) R73.1
_DOOR_7: Q18.1(G) Q20.3(C) R79.1
DOOR_0: D8.1(A) F1.2 P13.1 R27.1
DOOR_1: D13.1(A) F3.2 P15.1 R35.1
DOOR_2: D18.1(A) F5.2 P17.1 R44.1
DOOR_3: D23.1(A) F7.2 P19.1 R50.1
DOOR_4: D10.1(A) F2.2 P21.1 R59.1
DOOR_5: D15.1(A) F4.2 P23.1 R65.1
DOOR_6: D20.1(A) F6.2 P25.1 R74.1
DOOR_7: D25.1(A) F8.2 P27.1 R80.1
FB_DOOR_0: R27.2 R29.2
FB_DOOR_1: R35.2 R38.2
FB_DOOR_2: R44.2 R46.2
FB_DOOR_3: R50.2 R53.2
FB_DOOR_4: R59.2 R61.2
FB_DOOR_5: R65.2 R70.2
FB_DOOR_6: R74.2 R76.2
FB_DOOR_7: R80.2 R83.2
FB_RD_0: R26.2 R28.2
FB_RD_1: R34.2 R37.2
FB_RD_2: R43.2 R45.2
FB_RD_3: R49.2 R52.2
FB_RD_4: R58.2 R60.2
FB_RD_5: R64.2 R69.2
FB_RD_6: R73.2 R75.2
FB_RD_7: R79.2 R82.2
PWR_0: R36.2
PWR_1: R51.2
PWR_2: R66.2
PWR_3: R81.2
PWR_4: R86.2
PWR_5: R87.2
PWR_6: R84.2
PWR_7: R85.2
RD_0: P14.2 R25.1
RD_1: P16.2 R33.1
RD_2: P18.2 R40.1
RD_3: P20.2 R48.1
RD_4: P22.2 R57.1
RD_5: P24.2 R63.1
RD_6: P26.2 R72.1
RD_7: P28.2 R78.1
NetD7_2: D7.2(K) R30.1
NetD9_2: D9.2(K) R31.1
NetD11_2: D11.2(A) K1.5 Q6.3(C)
NetD12_2: D12.2(K) R41.1
NetD14_2: D14.2(K) R42.1
NetD16_2: D16.2(A) K2.5 Q11.3(C)
NetD17_2: D17.2(K) R54.1
NetD19_2: D19.2(K) R55.1
NetD21_2: D21.2(A) K3.5 Q16.3(C)
NetD22_2: D22.2(K) R67.1
NetD24_2: D24.2(K) R68.1
NetD26_2: D26.2(A) K4.5 Q21.3(C)
NetD27_2: D27.2(A) K5.5 Q22.3(C)
NetD28_2: D28.2(A) K6.5 Q23.3(C)
NetD29_2: D29.2(A) K7.5 Q24.3(C)
NetD30_2: D30.2(A) K8.5 Q25.3(C)
NetF1_1: F1.1 Q3.2(D) R30.2
NetF2_1: F2.1 Q4.2(D) R31.2
NetF3_1: F3.1 Q8.2(D) R41.2
NetF4_1: F4.1 Q9.2(D) R42.2
NetF5_1: F5.1 Q13.2(D) R54.2
NetF6_1: F6.1 Q14.2(D) R55.2
NetF7_1: F7.1 Q17.2(D) R67.2
NetF8_1: F8.1 Q18.2(D) R68.2
NetQ2_1: Q2.1(B) R24.1 R25.2
NetQ5_1: Q5.1(B) R32.1 R33.2
NetQ6_1: Q6.1(B) R36.1
NetQ7_1: Q7.1(B) R39.1 R40.2
NetQ10_1: Q10.1(B) R47.1 R48.2
NetQ11_1: Q11.1(B) R51.1
NetQ12_1: Q12.1(B) R56.1 R57.2
NetQ15_1: Q15.1(B) R62.1 R63.2
NetQ16_1: Q16.1(B) R66.1
NetQ19_1: Q19.1(B) R71.1 R72.2
NetQ20_1: Q20.1(B) R77.1 R78.2
NetQ21_1: Q21.1(B) R81.1
NetQ22_1: Q22.1(B) R84.1
NetQ23_1: Q23.1(B) R85.1
NetQ24_1: Q24.1(B) R86.1
NetQ25_1: Q25.1(B) R87.1

Not connected (* = marked no-connect by the designer): K1 3; K2 3; K3 3; K4 3; K5 3; K6 3; K7 3; K8 3

### Notes on the sheet
- Title
- Size:
- Date:
- A3
- Number:
- Time:
- Revision:
- Sheet
- of
- File:

### Library data of the parts
D7 D9 D12 D14 D17 D19 D22 D24 = HSMB-C190: as D1 on sheet DE-010824; Published: 11-Dec-2002; DatasheetVersion: 26-Feb-2002; PackageVersion: Mar-2002; PackageReference: 1.6X0.8X0.8; Publisher: Altium Limited; PackageDescription: SM LED; 2 Flat Leads; LED_Colour: Blue; ComponentLink1Description: Manufacturer Link; ComponentLink1URL: http://www.avagotech.com/; ComponentLink2Description: Datasheet; ComponentLink2URL: http://cp.literature.agilent.com/litweb/pdf/5988-5211EN.pdf
D8 D10 D13 D15 D18 D20 D23 D25 = D Schottky: Schottky Diode; Published: 8-Jun-2000; LatestRevisionDate: 17-Jul-2002; LatestRevisionNote: Re-released for DXP Platform.; PackageReference: SMB; Publisher: Altium Limited; PackageDescription: DO-214-AA/SMB; 2 C-Bend Leads; Body 5.3 x 3.6 mm, inc. leads (LxW); Code_JEDEC: DO-214-AA
D11 D16 D21 D26-D30 = 1PS76SB10: Schottky Barrier Diode; Published: 17-Sep-2003; LatestRevisionDate: 19-Mar-2004; LatestRevisionNote: Silkscreen size reduced.; DatasheetVersion: 14-Oct-1996; PackageVersion: May-1999; PackageReference: SOD323; Publisher: Altium Limited; PackageDescription: SOD-323/SC-76; 2 Leads; Body 1.7 x 1.3 mm, (LxW); ComponentLink1Description: Manufacturer Link; ComponentLink1URL: http://www.semiconductors.philips.com/; ComponentLink2Description: Datasheet; ComponentLink2URL: http://www.semiconductors.philips.com/acrobat/datasheets/1PS76SB10_2.pdf
F1-F8 = Fuse Thermal: Thermal Fuse; Published: 24-Mar-1999; LatestRevisionDate: 17-Jul-2002; LatestRevisionNote: Re-released for DXP Platform.; PackageReference: PIN-W2/E2.8; Publisher: Altium Limited; PackageDescription: Thru-Hole; 2 Leads
K1-K8 = SRD-12VDC-SL-O: SPDT PCB relay 12Vc coil
P13-P28 = TERMINAL BLOK 2: Terminal blok konektor 3,5 mm
Q2 Q5 Q7 Q10 Q12 Q15 Q19 Q20 = BC807: PNP General-purpose Transistor; Published: 17-Sep-2003; LatestRevisionDate: 12-Dec-2006; LatestRevisionNote: IPC-7351 Footprint Added.; DatasheetVersion: 8-Apr-1999; PackageVersion: May-1999; PackageReference: SOT23; Publisher: Altium Limited; PackageDescription: 3-Pin SOT-23 Package 0.95 mm Pitch, 2.3 mm Lead Span; ComponentLink1Description: Manufacturer Link; ComponentLink1URL: http://www.semiconductors.philips.com/; ComponentLink2Description: Datasheet; ComponentLink2URL: http://www.semiconductors.philips.com/acrobat/datasheets/BC807_BC807W_BC327_5.pdf
Q3 Q4 Q8 Q9 Q13 Q14 Q17 Q18 = NDF10N60ZG: N-Channel Power MOSFET 600 V, 0.75 Ohm, 3-Pin TO-220, Pb-Free, Tube; Manufacturer: On Semiconductor; Channel Polarity: N Channel; Ciss Typ (pF): 1373; Configuration: Single; Coss Typ (pF): 150; Crss Typ (pF): 35; PD Max (W): 39; Qrr Typ (nC): 3000; V(BR)DSS Min (V): 600; VGS Max (V): 30; VGS(th) Max (V): 4.5; DatasheetVersion: Rev. 12; PackageVersion: Rev. K, 02/2009; PackageReference: TO-220-3-221D-03; PackageDescription: 3-Pin Flange Mount, Vertical Straight Lead, Body 10.295 x 4.7 mm, Pitch 2.54 mm; Package Type: TO-220 FULLPAK-3; Packing: Tube; RoHS: Pb-Free; Mounting Technology: Through Hole; PartNumber: NDF10N60ZG; ComponentLink1Description: Manufacturer URL; ComponentLink1URL: http://www.onsemi.com/; ComponentLink2Description: Datasheet; ComponentLink2URL: http://www.onsemi.cn/pub_link/Collateral/NDF10N60Z-D.PDF; ComponentLink3Description: Package Specification; ComponentLink3URL: http://www.onsemi.com/pub_link/Collateral/221D-03.PDF
Q6 Q11 Q16 Q21-Q25 = BC817: NPN General-purpose Transistor; Published: 17-Sep-2003; LatestRevisionDate: 12-Dec-2006; LatestRevisionNote: IPC-7351 Footprint Added.; DatasheetVersion: Jun-1999; PackageVersion: May-1999; PackageReference: SOT23; Publisher: Altium Limited; PackageDescription: 3-Pin SOT-23 Package 0.95 mm Pitch, 2.3 mm Lead Span; ComponentLink1Description: Manufacturer Link; ComponentLink1URL: http://www.semiconductors.philips.com/; ComponentLink2Description: Datasheet; ComponentLink2URL: http://www.semiconductors.philips.com/acrobat/datasheets/BC817_BC817W_BC337_5.pdf
R24-R87 = ERAV: as R1 on sheet DE-010824; Published: 17-Dec-2003; LatestRevisionDate: 19-Mar-2004; LatestRevisionNote: Silkscreen size reduced.; PackageDocument: Mar-2003; PackageReference: ERA-0603; Publisher: Altium Limited; Code_IPC: 1608 [0603]; ComponentLink1Description: Manufacturer Link; ComponentLink1URL: http://www.panasonic.com/industrial/components/resistive_products.htm; ComponentLink2Description: Datasheet; ComponentLink2URL: http://www.panasonic.com/industrial/components/pdf/AOF0000CE1.pdf

## Nets that join several sheets
12V: DE-010824 (5 pins), DE-010824_02 (24 pins)
GND: DE-010824 (58 pins), DE-010824_02 (40 pins)
FB_DOOR_0: DE-010824 (U1.10), DE-010824_02 (R27.2 R29.2)
FB_DOOR_1: DE-010824 (U1.11), DE-010824_02 (R35.2 R38.2)
FB_DOOR_2: DE-010824 (U1.12), DE-010824_02 (R44.2 R46.2)
FB_DOOR_3: DE-010824 (U1.13), DE-010824_02 (R50.2 R53.2)
FB_DOOR_4: DE-010824 (U1.14), DE-010824_02 (R59.2 R61.2)
FB_DOOR_5: DE-010824 (U1.15), DE-010824_02 (R65.2 R70.2)
FB_DOOR_6: DE-010824 (U1.16), DE-010824_02 (R74.2 R76.2)
FB_DOOR_7: DE-010824 (U1.17), DE-010824_02 (R80.2 R83.2)
FB_RD_0: DE-010824 (U1.18), DE-010824_02 (R26.2 R28.2)
FB_RD_1: DE-010824 (U1.19), DE-010824_02 (R34.2 R37.2)
FB_RD_2: DE-010824 (U1.20), DE-010824_02 (R43.2 R45.2)
FB_RD_3: DE-010824 (U1.39), DE-010824_02 (R49.2 R52.2)
FB_RD_4: DE-010824 (U1.40), DE-010824_02 (R58.2 R60.2)
FB_RD_5: DE-010824 (U1.41), DE-010824_02 (R64.2 R69.2)
FB_RD_6: DE-010824 (U1.42), DE-010824_02 (R73.2 R75.2)
FB_RD_7: DE-010824 (U1.43), DE-010824_02 (R79.2 R82.2)
PWR_0: DE-010824 (U1.45), DE-010824_02 (R36.2)
PWR_1: DE-010824 (U1.46), DE-010824_02 (R51.2)
PWR_2: DE-010824 (U1.21), DE-010824_02 (R66.2)
PWR_3: DE-010824 (U1.22), DE-010824_02 (R81.2)
PWR_4: DE-010824 (U1.25), DE-010824_02 (R86.2)
PWR_5: DE-010824 (U1.26), DE-010824_02 (R87.2)
PWR_6: DE-010824 (U1.27), DE-010824_02 (R84.2)
PWR_7: DE-010824 (U1.28), DE-010824_02 (R85.2)